# EAGLE design chestnut-tube-amp (EAGLE 6.3)
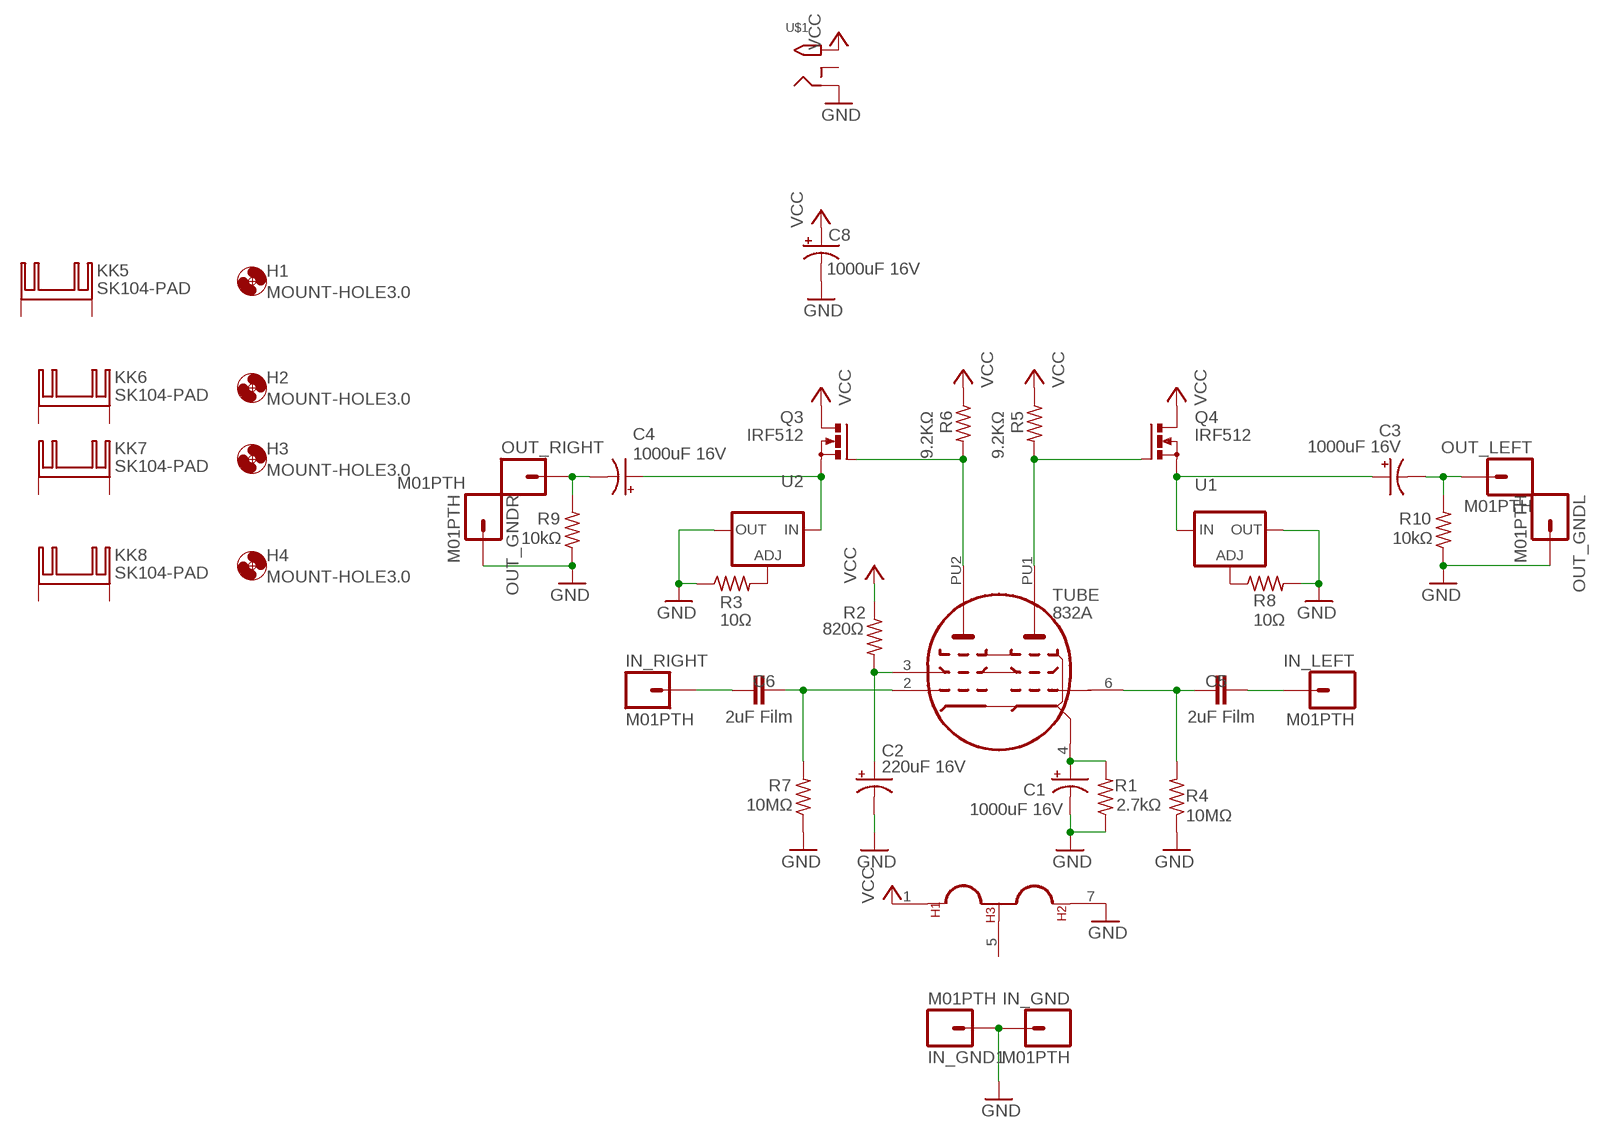
[diagram p0: schematic, sheet 1]

## Parts
C1  1000uF 16V  CPOL-USE5-10.5  [E5-10,5]
C2  220uF 16V  CPOL-USE2.5-7  [E2,5-7]
C3  1000uF 16V  CPOL-USE5-10.5  [E5-10,5]
C4  1000uF 16V  CPOL-USE5-10.5  [E5-10,5]
C5  2uF Film  C-EU375-155X418  [C375-155X418]
C6  2uF Film  C-EU375-155X418  [C375-155X418]
C8  1000uF 16V  CPOL-USE5-10.5  [E5-10,5]
H1  MOUNT-HOLE3.0  [3,0]
H2  MOUNT-HOLE3.0  [3,0]
H3  MOUNT-HOLE3.0  [3,0]
H4  MOUNT-HOLE3.0  [3,0]
IN_GND  M01PTH  [1X01]
IN_GND1  M01PTH  [1X01]
IN_LEFT  M01PTH  [1X01]
IN_RIGHT  M01PTH  [1X01]
KK5  SK104-PAD  [SK104-PAD]
KK6  SK104-PAD  [SK104-PAD]
KK7  SK104-PAD  [SK104-PAD]
KK8  SK104-PAD  [SK104-PAD]
OUT_GNDL  M01PTH  [1X01]
OUT_GNDR  M01PTH  [1X01]
OUT_LEFT  M01PTH  [1X01]
OUT_RIGHT  M01PTH  [1X01]
Q3  IRF512  [TO220BV]
Q4  IRF512  [TO220BV]
R1  2.7kΩ  R-US_0207/7  [0207/7]
R2  820Ω  R-US_0207/7  [0207/7]
R3  10Ω  R-US_0207/7  [0207/7]
R4  10MΩ  R-US_0207/7  [0207/7]
R5  9.2KΩ  R-US_0207/7  [0207/7]
R6  9.2KΩ  R-US_0207/7  [0207/7]
R7  10MΩ  R-US_0207/7  [0207/7]
R8  10Ω  R-US_0207/7  [0207/7]
R9  10kΩ  R-US_0207/7  [0207/7]
R10  10kΩ  R-US_0207/7  [0207/7]
TUBE  832A  [832A]
U1  LM317TS  [317TS]
U2  LM317TS  [317TS]
U$1  2.1MMJACKTHM  [PJ-102A]

## Nets
GND: C1.- C2.- C8.- IN_GND1.1 IN_GND.1 OUT_GNDL.1 OUT_GNDR.1 R1.1 R3.1 R4.1 R7.1 R8.2 R9.1 R10.1 TUBE.7 U1.2(OUT) U2.2(OUT) U$1.RING
N$1: C2.+ R2.2 TUBE.3
N$2: Q3.G R6.2 TUBE.PU2
N$3: C6.2 R7.2 TUBE.2
N$4: C5.2 R4.2 TUBE.6
N$5: R3.2 U2.1(ADJ)
N$6: Q4.G R5.2 TUBE.PU1
N$7: C5.1 IN_LEFT.1
N$8: C1.+ R1.2 TUBE.4
N$9: C4.+ Q3.S U2.3(IN)
N$10: C3.+ Q4.S U1.3(IN)
N$11: R8.1 U1.1(ADJ)
N$12: C6.1 IN_RIGHT.1
N$13: C3.- OUT_LEFT.1 R10.2
N$14: C4.- OUT_RIGHT.1 R9.2
VCC: C8.+ Q3.D Q4.D R2.1 R5.1 R6.1 TUBE.1 U$1.TIP
Unconnected: KK5.K1(K) KK5.K2(K) KK6.K1(K) KK6.K2(K) KK7.K1(K) KK7.K2(K) KK8.K1(K) KK8.K2(K) TUBE.5 U$1.RING_SW

## Library data of the parts
C1-C4 C8 = rcl:CPOL-US: POLARIZED CAPACITOR, American symbol
C5 C6 = rcl:C-EU: CAPACITOR, European symbol
H1-H4 = holes:MOUNT-HOLE: MOUNTING HOLE with drill center marker
IN_GND IN_GND1 IN_LEFT IN_RIGHT OUT_GNDL OUT_GNDR OUT_LEFT OUT_RIGHT = SparkFun-Connectors:M01: Header 1 Standard 1-pin 0.1" header. Use with straight break away headers (SKU : PRT-00116), right angle break away headers (PRT-00553), swiss pins (PRT-00743), machine pins (PRT-00117), and female headers (PRT-00115).
KK5-KK8 = heatsink:SK104-PAD: HEATSINK manufacturer Fischer/distributor Buerklin
Q3 Q4 = transistor-power:IRF512: N-CHANNEL MOS FET
R1-R10 = resistor:R-US_: RESISTOR, American symbol
TUBE = tubes:832A
U1 U2 = v-reg:LM317TS: VOLTAGE REGULATOR
U$1 = adafruit:2.1MMJACK: 2.1mm x 5.5mm THM DC jack with internal switch. Digikey part #PJ-102A, 4UCON part #05537 2.1mm x 5.5mm SMT DC jack with internal switch. Digikey part #PJ-002A-SMT, 4UCON part #03267 By microbuilder.eu & adafruit.com

## Board
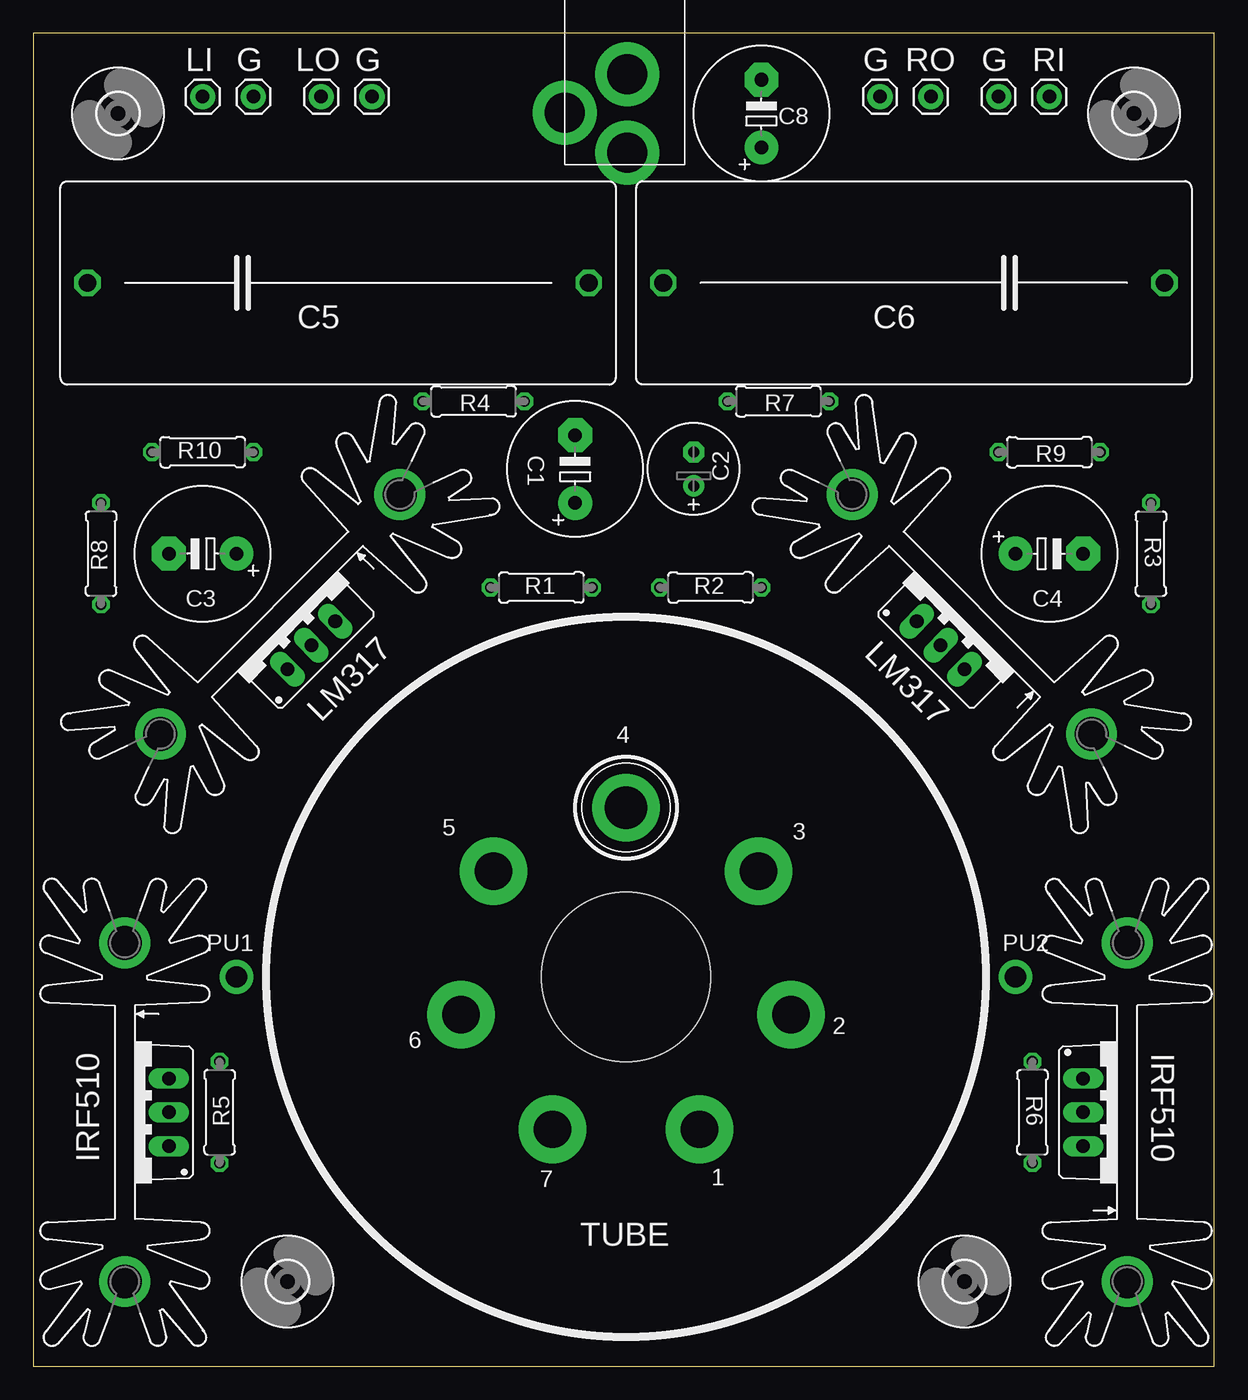
[diagram p1: board, top side]
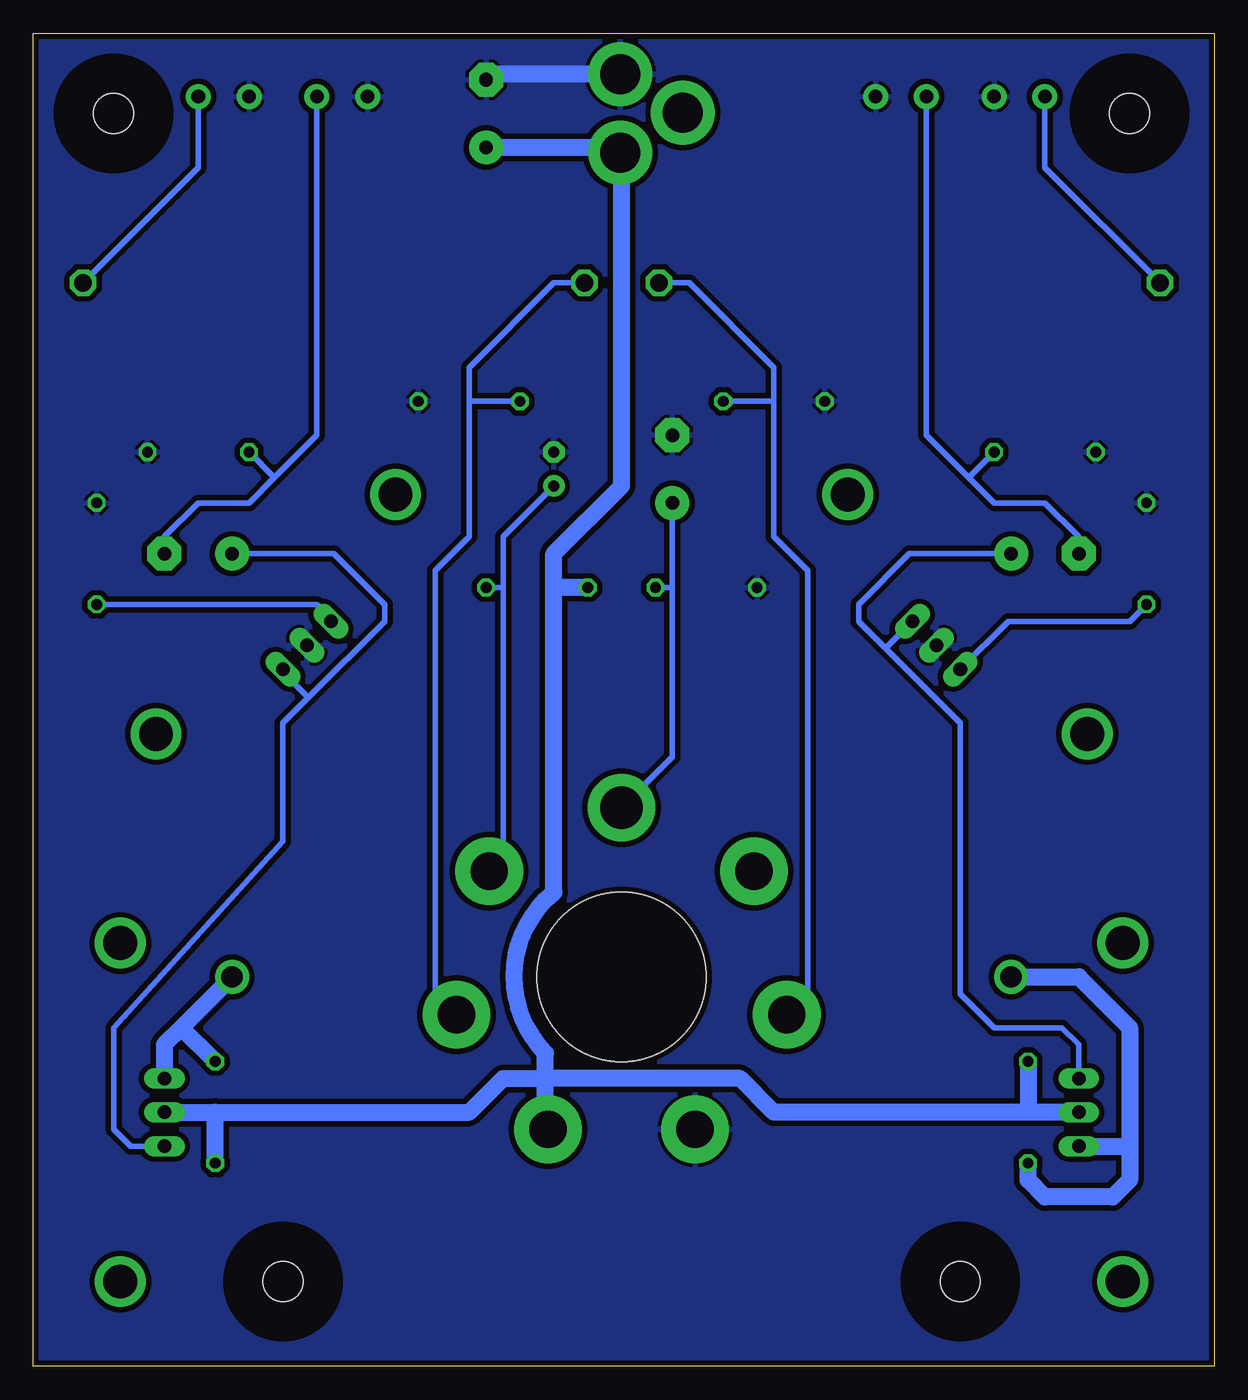
[diagram p2: board, bottom side, seen from below]

Size 88.57 x 100 mm. Coordinates in mm from the lower left corner, seen from the top.
Outline: 0,100 0,0 88.57,0 88.57,100 0,100
Copper layers (1*16): Top 0.035mm / dielectric 1.5mm / Bottom 0.035mm
Design rules "ElecFreaks_CAM_DRC_V1.0": minimum track width 6mil, minimum drill 12mil, track to track 6mil, track to pad 6mil, pad to pad 6mil, via to via 6mil, smd to smd 0mil, copper to edge 10mil, drill to drill 10mil, minimum pad ring 10mil, minimum via ring 6mil, stop-mask expansion 2mil, vias tented up to drill 100mil, thermal gap 10mil
Holes 12.7 mm at 44.45,29.21

### Footprints (pad centres in the part's own frame; a part is rotated, then mirrored left to right if it is on the bottom)
E5-10,5 = drill 1.016 pad 2.54: + -2.54,0 | drill 1.016 pad 2.54 octagon: - 2.54,0
E2,5-7 = drill 0.813 pad 1.6: + -1.27,0 | drill 0.813 pad 1.6 octagon: - 1.27,0
C375-155X418 = drill 1.321 octagon: 1 -18.796,0; 2 18.796,0
3,0 = hole 3: 0,0
1X01 = drill 1.016 pad 1.88: 1 0,0
SK104-PAD = drill 2.54 pad 3.81: K1 -12.7,-0.762; K2 12.7,-0.762
TO220BV = drill 1.016 long: D 0,-2.54; G -2.54,-2.54; S 2.54,-2.54
0207/7 = drill 0.813 octagon: 1 -3.81,0; 2 3.81,0
832A = drill 2.8 pad 5.08: 1 5.51,-11.442; 2 12.382,-2.826; 3 9.929,7.918; 5 -9.929,7.918; 6 -12.382,-2.826; 7 -5.51,-11.442 | drill 3.2 pad 5.08: 4 0,12.7 | drill 1.6 pad 2.54: PU1 -29.21,0; PU2 29.21,0
317TS = drill 1.016 long: 1 -2.54,-2.54; 2 0,-2.54; 3 2.54,-2.54
PJ-102A = drill 3 pad 4.8: RING 0.1,-3.39; RING_SW -4.6,-6.29; TIP 0.1,-9.29

### Placement (x,y rotation side)
C1  40.64,67.31 90 top
C2  49.53,67.31 90 top
C3  12.7,60.96 180 top
C4  76.2,60.96 0 top
C5  22.86,81.28 0 top
C6  66.04,81.28 180 top
C8  54.61,93.98 90 top
H1  6.35,93.98 0 top
H2  19.05,6.35 0 top
H3  69.85,6.35 0 top
H4  82.55,93.98 0 top
IN_GND  16.51,95.25 270 top
IN_GND1  72.39,95.25 270 top
IN_LEFT  12.7,95.25 270 top
IN_RIGHT  76.2,95.25 270 top
KK5  69.85,55.88 135 top
KK6  81.28,19.05 90 top
KK7  7.62,19.05 270 top
KK8  19.05,55.88 225 top
OUT_GNDL  25.4,95.25 270 top
OUT_GNDR  63.5,95.25 270 top
OUT_LEFT  21.59,95.25 270 top
OUT_RIGHT  67.31,95.25 270 top
Q3  81.28,19.05 270 top
Q4  7.62,19.05 90 top
R1  38.1,58.42 0 top
R2  50.8,58.42 0 top
R3  83.82,60.96 270 top
R4  33.02,72.39 0 top
R5  13.97,19.05 270 top
R6  74.93,19.05 90 top
R7  55.88,72.39 180 top
R8  5.08,60.96 90 top
R9  76.2,68.58 180 top
R10  12.7,68.58 0 top
TUBE  44.45,29.21 0 top
U1  19.05,55.88 45 top
U2  69.85,55.88 315 top
U$1  44.45,100.33 0 top

### Tracks (layer width: path | path; a pad name or v marks a point on that pad's centre or on a via)
GND
  Bottom 1.27: U$1.RING 54.19,96.94 C8.-
  pour Bottom (isolate 0.406): 0,0 88.9,0 88.9,101.6 0,101.6
N$1
  Bottom 0.406: TUBE.3 53.34,38.17 53.34,58.42 | 53.34,58.42 53.34,62.23 C2.+ | R2.2 53.34,58.42
N$2
  Bottom 1.27: TUBE.PU2 77.47,25.4 | 77.47,25.4 78.74,24.13 Q3.G | R6.2 77.47,25.4
N$3
  Bottom 0.406: C6.2 49.53,81.28 55.88,74.93 55.88,72.39 | TUBE.2 58.42,27.97 58.42,59.69 55.88,62.23 55.88,72.39 | R7.2 55.88,72.39
N$4
  Bottom 0.406: C5.2 39.37,81.28 33.02,74.93 33.02,72.39 | TUBE.6 30.48,27.97 30.48,59.69 33.02,62.23 33.02,72.39 | R4.2 33.02,72.39
N$5
  Bottom 0.406: U2.1 66.26,56.1 67.31,57.15 R3.2
N$6
  Bottom 1.27: TUBE.PU1 10.16,29.21 6.35,25.4 6.35,16.51 | 6.35,16.51 6.35,13.97 7.62,12.7 12.7,12.7 13.97,13.97 R5.2 | Q4.G 6.35,16.51
N$7
  Bottom 0.406: IN_LEFT.1 12.7,89.92 C5.1
N$8
  Bottom 0.406: C1.+ 40.64,58.42 | 40.64,58.42 40.64,45.72 TUBE.4 | R1.2 40.64,58.42
N$9
  Bottom 0.406: Q3.S 81.28,16.51 82.55,17.78 82.55,25.4 69.85,39.37 69.85,48.26 67.94,50.16 | U2.3 69.85,52.07 67.94,50.16 | 67.94,50.16 62.23,55.88 62.23,57.15 66.04,60.96 C4.+
N$10
  Bottom 0.406: 24.77,53.98 19.05,48.26 19.05,27.94 16.51,25.4 11.43,25.4 10.16,24.13 Q4.S | 24.77,53.98 26.67,55.88 26.67,57.15 22.86,60.96 C3.+ | U1.3 24.55,53.98 24.77,53.98
N$11
  Bottom 0.406: R8.1 6.35,55.88 15.46,55.88 U1.1
N$12
  Bottom 0.406: IN_RIGHT.1 76.2,89.92 C6.1
N$13
  Bottom 0.406: OUT_LEFT.1 21.59,69.85 18.41,66.67 | C3.- 10.16,62.23 12.7,64.77 16.51,64.77 18.41,66.67 | R10.2 18.41,66.67
N$14
  Bottom 0.406: OUT_RIGHT.1 67.31,69.85 70.48,66.67 | C4.- 78.74,62.23 76.2,64.77 72.39,64.77 70.48,66.67 | R9.2 70.48,66.67
VCC
  Bottom 1.27: C8.+ 44.95,91.44 U$1.TIP 44.45,90.94 44.45,66.04 49.53,60.96 49.53,58.42 | TUBE.1 50.16,17.77 50.16,21.59 | 50.16,21.59 50.16,23.5 arc95 49.53,35.56 49.53,58.42 | R2.1 49.53,58.42 | Q3.D 74.93,19.05 | 74.93,19.05 55.88,19.05 53.34,21.59 50.16,21.59 | R6.1 74.93,19.05 | Q4.D 13.97,19.05 | 13.97,19.05 33.02,19.05 35.56,21.59 50.16,21.59 | R5.1 13.97,19.05

### Text on the board
tNames: LI | G | LO | G | G | RO | G | RI | LM317 | LM317 | IRF510 | IRF510